# Altium project 404Final.PrjPcb
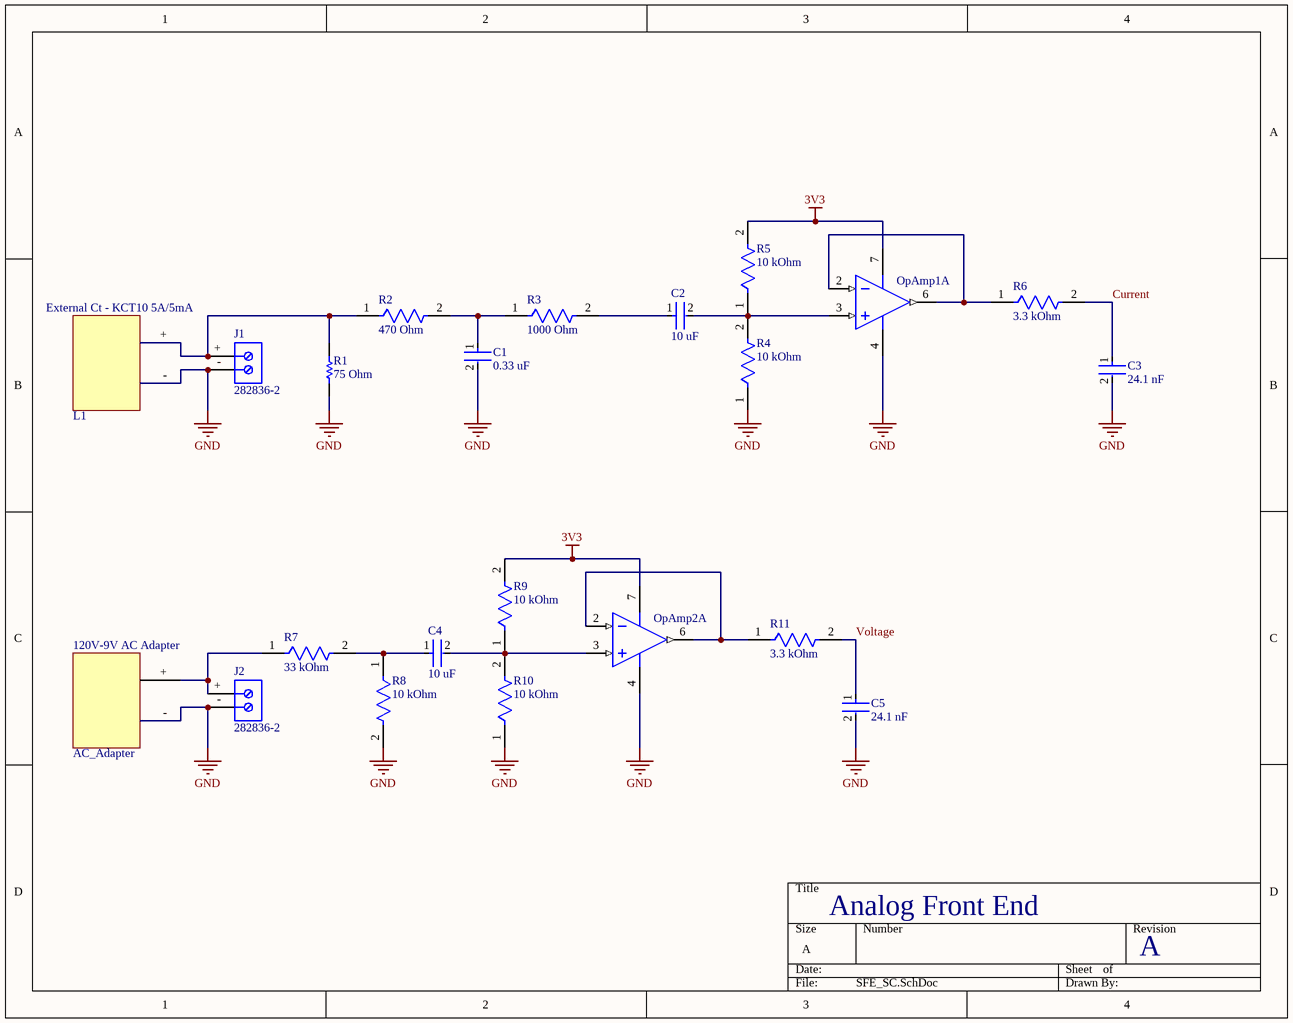
[diagram p0: SFE_SC.SchDoc]
1 sheet, 22 parts. Net scope: global (net labels, ports and power ports of the same name join across sheets).
Board file: Final PCB.PcbDoc

## Sheet SFE_SC.SchDoc
size A; SheetNumber: 1; SheetTotal: 3

### Parts
Adapter  AC_Adapter
C1  0.33 uF  [FP-CGA3E-0_3-0_1-IPC_B]
C2  10 uF  [FP-CL21-IPC_B]
C3  24.1 nF  [FP-CL10-IPC_C]
C4  10 uF  [FP-CL21-IPC_B]
C5  24.1 nF  [FP-CL10-IPC_C]
Ct_clamp  L1
J1  282836-2  [TECO-282836-2_V]
J2  282836-2  [TECO-282836-2_V]
OpAmp1  TLV2461ID  [D0008A_N]  (value not drawn)  (part A of 2)
OpAmp2  TLV2461ID  [D0008A_N]  (value not drawn)  (part A of 2)
R1  75 Ohm  [RESC3225X60X45LL20T20]
R2  470 Ohm  [FP-CRGCQ0603-IPC_C]
R3  1000 Ohm  [FP-RMCF0603-MFG]
R4  10 kOhm  [FP-RC0603-0_55-IPC_C]
R5  10 kOhm  [FP-RC0603-0_55-IPC_C]
R6  3.3 kOhm  [FP-RC0603-0_55-MFG]
R7  33 kOhm  [FP-RT0402-MFG]
R8  10 kOhm  [FP-RMCF0603-MFG]
R9  10 kOhm  [FP-RC0603-0_55-IPC_C]
R10  10 kOhm  [FP-RC0603-0_55-IPC_C]
R11  3.3 kOhm  [FP-RC0603-0_55-MFG]

### Nets
3V3: OpAmp1.7(VDD+) OpAmp2.7(VDD+) R5.2 R9.2
GND: Adapter.- C1.2 C3.2 C5.2 Ct_clamp.- J1.- J2.- OpAmp1.4(GND) OpAmp2.4(GND) R1.1 R4.1 R8.2 R10.1
Current: C3.1 R6.2
Voltage: C5.1 R11.2
NetC1_1: C1.1 R2.2 R3.1
NetC2_1: C2.1 R3.2
NetC2_2: C2.2 OpAmp1.3(IN+) R4.2 R5.1
NetC4_1: C4.1 R7.2 R8.1
NetC4_2: C4.2 OpAmp2.3(IN+) R9.1 R10.2
NetCt_clamp_+: Ct_clamp.+ J1.+ R1.2 R2.1
NetJ2_+: J2.+ R7.1
NetOpAmp1_2: OpAmp1.2(IN-) OpAmp1.6(OUT) R6.1
NetOpAmp2_2: OpAmp2.2(IN-) OpAmp2.6(OUT) R11.1

Not connected (* = marked no-connect by the designer): Adapter +

### Notes on the sheet
- Analog Front End
- A
- (in symbol AC_Adapter) 120V-9V AC Adapter
- (in symbol Component_1) External Ct - KCT10 5A/5mA

### Library data of the parts
C1 = CMP-08246-003263-1: Cap Ceramic 330nF 50V X7R 10% Pad SMD 0603 +125°C Automotive T/R; Thickness: 0.035inch; Package Quantity: 4000; Weight: 7.1E-05oz; Dielectric: X7R; Height: 0.8mm; Termination: SMD/SMT; Voltage Rating (DC): 50V; Length: 0.063inch; Packaging: Tape and Reel; Width: 0.031inch; Ratings: AEC-Q200; Tolerance: 10%; Min Operating Temperature: -55°C; Capacitance: 330nF; Max Operating Temperature: 125°C; Voltage Rating: 50V; Mount: Surface Mount; RoHS Compliant: Yes; Case Code (Imperial): 0603; Case/Package: 0603; Case Code (Metric): 1608
C2 C4 = CMP-13271-001796-1: CL21 Series 0805 10uF 10V ±10% Tolerance X5R Multilayer Ceramic Chip Capacitor; Lead Free: Lead Free; Packaging: Tape and Reel; Capacitance: 10uF; Case Code (Imperial): 0805; Length: 2mm; Thickness: 0.053inch; Depth: 1.25mm; Mount: Surface Mount; Voltage: 10V; Case/Package: 0805; Dielectric: X5R; Height: 1.25mm; Voltage Rating: 10V; Radiation Hardening: No; Tolerance: 10%; Package Quantity: 3000; Min Operating Temperature: -55°C; Case Code (Metric): 2012; Width: 0.049inch; Max Operating Temperature: 85°C; Termination: Wraparound
C3 C5 = CMP-13271-001437-1: Cap Ceramic 22nF 50V X7R ±10% Pad SMD 0603 +125°C T/R; Max Operating Temperature: 125°C; Material: Ceramic; Voltage Rating (DC): 50V; Packaging: Tape and Reel; Radiation Hardening: No; Thickness: 0.035inch; Voltage Rating: 50V; Min Operating Temperature: -55°C; Width: 0.031inch; Voltage: 50V; Lead Free: Lead Free; Contact Plating: Tin; Case Code (Imperial): 0603; Tolerance: 10%; Case Code (Metric): 1608; Capacitance: 22nF; Case/Package: 0603; Mount: Surface Mount; Height: 0.8mm; Depth: 0.8mm; Length: 1.6mm; Dielectric: X7R; Package Quantity: 1
Ct_clamp = Component_1
J1 J2 = CMP-1684-00017-1: Female Header, Pitch 5 mm, 1 x 2 Position, Height 10 mm, Tail Length 3.5 mm, Rohs, Bulk; Manufacturer: TE Connectivity; Wire Gauge: 16-30AWG; Product Training Modules: Wire-to-BoardEurostyleTerminalBlocks; Clamp Material - Plating: Brass-NickelPlated; Voltage: 300V; Mating Orientation: HorizontalwithBoard; Current: 13.5A; Pitch: 0.197"(5.00mm); Screw Thread: M3; 3D Model: 282836-2.pdf; Other Names: 5ULV-02B / A98076; Dynamic Catalog: BuchananSeries; Number of Levels: 1; Torque - Screw: 0.68Nm(6Lb-In); Featured Product: EurostyleTerminalBlockConnectors; Positions Per Level: 2; Wire Termination: Screw-RisingCageClamp; Datasheet URL: http://www.te.com.cn/commerce/DocumentDelivery/DDEController?Action=showdoc&DocId=Catalog+Section%7F1308389_EUROSTYLE_TERMINAL_BLOCKS%7F0607%7Fpdf%7FEnglish%7FENG_CS_1308389_EUROSTYLE_TERMINAL_BLOCKS_0607.pdf%7F282836-2; Color: Green; Family: TerminalBlocks-WiretoBoard; RoHS Information: 282836-2StatementofCompliance; Standard Package: 300; Contact Material - Plating: Brass-TinPlated; Manufacturer URL: http://www.te.com; Housing Material: Polyamide(PA66),Nylon6/6; Features: Interlocking(Side); Package Description: Female Header, Pitch 5 mm, 1 x 2 Position, Height 10 mm, Tail Length 3.5 mm; Mounting Type: ThroughHole; Package Reference: THD; Packaging: Bulk; Series: Buchanan; Category: Connectors,Interconnects; Screw Material - Plating: Brass-NickelPlated
OpAmp1 OpAmp2 = CMP-0272-00303-3: Single, Low Power, Rail-to-Rail Input / Output Operational Amplifier, 2.7 to 6 V, -40 to 125 degC, 8-pin SOIC (D8), Green (RoHS & no Sb/Br); Manufacturer: Texas Instruments; Vn at 1kHz(Typ)(nV/rtHz): 11; Vio (25C)(Max)(mV): 2; CMRR(Min)(dB): 66; Total Supply Voltage(Min)(+5V is 5, +/-5V is 10): 2.7; Number of Channels: 1; Total Supply Voltage(Max)(+5V is 5, +/-5V is 10): 6; IIB(Max)(pA): 14000; Iq per channel(Max)(mA): 0.575; Slew Rate(Typ)(V/us): 1.6; Sub Family: High Output Current Amplifier (>=50mA), Low Supply Voltage Amplifier (<=2.7V), Precision Amplifier; PartNumber: TLV2461ID; PackageDescription: 8-Pin Plastic Small Outline, Body 4.9 x 3.9 mm, Pitch 1.27 mm; Offset Drift(Typ)(uV/C): 2; ComponentLink1URL: http://www.ti.com/; PackageVersion: 4040047-3/M, 06/2011; ComponentLink3URL: http://www.ti.com/litv/pdf/msoi002j; DatasheetVersion: SLOS220J; Code_JEDEC: MS-012; Mounting Technology: Surface Mount; ComponentLink1Description: Manufacturer URL; Eco-Plan: Green (RoHS & no Sb/Br); ComponentLink2URL: http://www.ti.com/general/docs/lit/getliterature.tsp?genericPartNumber=TLV2461&fileType=pdf; ComponentLink3Description: Package Specification; ComponentLink2Description: Datasheet; PackageReference: D0008A
R1 = CMP-2005-00253-1: Part Number: CRCW121075R0FKEAHP; Manufacturer: Vishay Dale
R2 = CMP-03211-002978-1: CRGCQ 0603 470R 1%; Manufacturer: TE Connectivity; Manufacturer Part Number: CRGCQ0603F470R; Power Rating: 0.1W; Resistance: 470Ω; Temperature Coefficient: ±100ppm/°C; Value: 470Ω; Voltage Rating: 75V; Tolerance: 0.01; Description: CRGCQ0603 470Ω 1% ±100ppm/°C 75V; Device Class L1: Passive Components; Category: Res; Temperature Range High: +155°C; Lead Free: Yes; Octopart: https://octopart.com/crgcq0603f470r-te+connectivity-91018076; RoHS: TRUE; Composition: Thick Film; Height: 0.55mm; Digikey Description: CRGCQ 0603 470R 1%; Temperature Range Low: -55°C; Package: CRGCQ0603; Temperature: -55°C to +155°C; Ambient Temperature Range High: +70°C; Series: CRGCQ; Ipc Land Pattern Name: RESC16080X45; ComponentLink2URL: https://www.te.com/commerce/DocumentDelivery/DDEController?Action=showdoc&DocId=Data+Sheet%7F1773204-3%7F1%7Fpdf%7FEnglish%7FENG_DS_1773204-3_1.pdf%7F4-2176339-618; Device Class L3: Chip SMD Resistors; Device Class L2: Resistors; ComponentLink2Description: Datasheet
R3 = CMP-26527-000152-1: 1kΩ ±1% 0.1W 0603 Thick Film Chip Resistor AEC-Q200 compliant; Resistance: 1kR; Max Power Dissipation: 100mW; Temperature Coefficient: 100ppm/°C; Packaging: Tape and Reel; Mount: Surface Mount; RoHS Compliant: Yes; Construction: Rectangular; Width: 0.031inch; Case Code (Imperial): 0603; Contact Plating: Tin; Length: 1.55mm; Lead Free: Lead Free; Case Code (Metric): 1608; Size Code: 0603; Depth: 0.8mm; Series: RMCF; Power Rating: 100mW; Height: 0.022inch; Case/Package: 0603; Tolerance: 1%; Min Operating Temperature: -55°C; Military Standard: Not; Features: Automotive AEC-Q200; Max Operating Temperature: 155°C; Number of Terminations: 2; Radiation Hardening: No; Resistor Type: Thick Film
R4 R5 R9 R10 = CMP-2100-03664-2: RES 10K OHM 1% 1/10W 0603; Voltage Rating: 75V; Voltage Rating (DC): 50V; Resistance: 10kR; Power Rating: 100mW; Temperature Coefficient: 100ppm/°C; Depth: 0.8mm; Termination: SMD/SMT; Resistor Type: Thick Film; Series: RC; Construction: Rectangular; Features: Moisture Resistant; Packaging: Tape and Reel; Min Operating Temperature: -55°C; Number of Terminations: 2; Lead Pitch: 0.3mm; RoHS Compliant: Yes; Case/Package: 0603; Resistance Tolerance: 1%; Military Standard: Not; Weight: 7.1E-05oz; Number of Pins: 2; Tolerance: 1%; Length: 1.6mm; Case Code (Imperial): 0603; Lead Free: Lead Free; Width: 0.8mm; Max Power Dissipation: 100mW; Height: 0.45mm; Max Operating Temperature: 155°C; Case Code (Metric): 1608; Size Code: 0603
R6 R11 = CMP-1012-00567-3: NexarPartId: 40011875; Tolerance: 1%; Power Rating: 100mW; Temperature Coefficient: 100ppm/°C; Voltage Rating (DC): 50V; Resistance: 3.3kΩ; Military Standard: Not; Case/Package: 0603; Mount: Surface Mount; Lead Free: Lead Free; Packaging: Tape & Reel; Termination: SMD/SMT; Number of Terminations: 2; Composition: Thick Film; Length: 1.6mm; Max Power Dissipation: 100mW; Width: 800µm; Features: Moisture Resistant; Max Operating Temperature: 155°C; Depth: 800µm; Number of Pins: 2; REACH SVHC: No SVHC; Case Code (Imperial): 0603; Case Code (Metric): 0603; RoHS: Compliant; Voltage Rating (AC): 50V; Voltage Rating: 50V; Schedule B: 8533210045, 8533210045; Min Operating Temperature: -55°C; Height: 450µm
R7 = CMP-2002-02945-2: RES SMD 33K OHM 0.1% 1/16W 0402; Manufacturer Part Number: RT0402BRD0733KL; Manufacturer: Yageo; Temperature Coefficient: 25 ppm/°C; Value: 33KΩ; Voltage Rating: 50V; Tolerance: 0.001; Power Rating: 0.063W; Automotive: No; Series: RT; ComponentLink2Description: Datasheet; Temperature Range High: +155°C; Temperature: -55°C to +155°C; Footprint Url: http://www.yageo.com/exep/pages/download/literatures/PYu-R_Mount_10.pdf; Octopart: https://octopart.com/rt0402brd0733kl-yageo-1394589; Resistance: 33KΩ; Height: 0.35mm; Digikey Description: RES SMD 33K OHM 0.1% 1/16W 0402; Device Class L1: Passive Components; Temperature Range Low: -55°C; ComponentLink2URL: http://www.yageo.com/documents/recent/PYu-RT_1-to-0.01_RoHS_L_9.pdf; Device Class L3: Chip SMD Resistors; Composition: Thin Film; RoHS: TRUE; Lead Free: Yes; Ipc Land Pattern Name: RESC10050X30; Device Class L2: Resistors; Package: RT0402; Mouser Description: Thin Film Resistors 1/16W 33K ohm .1% 25ppm; Category: Res
R8 = CMP-2000-06990-2: 10kΩ ±1% 0.1W 0603 Thick Film Chip Resistor AEC-Q200 compliant; Max Power Dissipation: 100mW; Resistance: 10kR; Temperature Coefficient: 100ppm/°C; Military Standard: Not; Mount: Surface Mount; Depth: 0.8mm; Height: 0.022inch; Size Code: 0603; Case/Package: 0603; Resistor Type: Thick Film; Min Operating Temperature: -55°C; Length: 1.55mm; Construction: Rectangular; Case Code (Imperial): 0603; Packaging: Tape and Reel; Radiation Hardening: No; Power Rating: 100mW; Max Operating Temperature: 155°C; Contact Plating: Tin; Case Code (Metric): 1608; Lead Free: Lead Free; Series: RMCF; Tolerance: 1%; Features: Automotive AEC-Q200; Number of Terminations: 2; RoHS Compliant: Yes; Width: 0.031inch